# Altium schematic sheet MB1256.SchDoc: MICRO SD Module board
size A4; DocumentNumber: MB1256; Revision: A.1; SheetNumber: 1; SheetTotal: 1; Project: STM32H7-EVAL
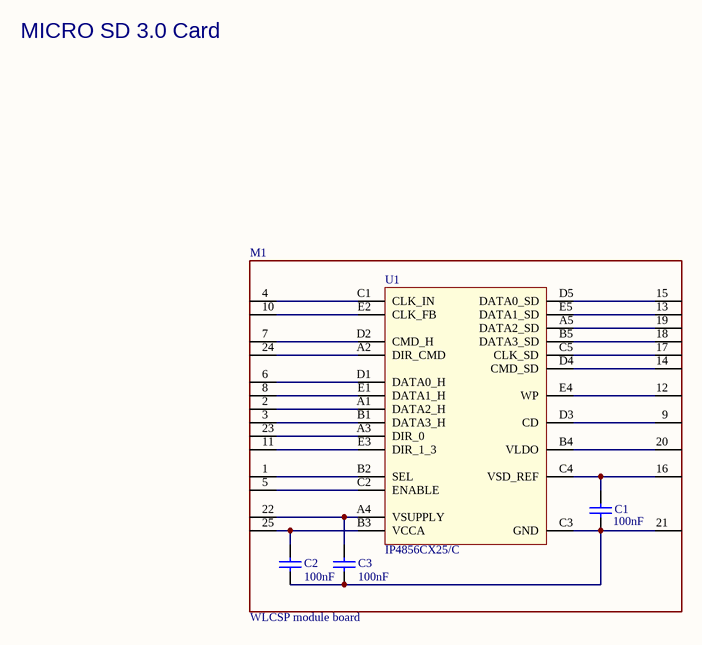
[diagram p0: MB1256.SchDoc]

## Parts
C1  100nF  [0402C]
C2  100nF  [0402C]
C3  100nF  [0402C]
M1  WLCSP module board  [WLCSP25_0R4_2R05X2R05_module]
U1  IP4856CX25/C  [WLCSP25_0R4_2R05X2R05]

## Nets
NetC1_1: C1.1 M1.16(DATA1_SD) U1.C4(VSD_REF)
NetC1_2: C1.2 C2.2 C3.2 M1.21(WP) U1.C3(GND)
NetC2_1: C2.1 M1.25(GND) U1.B3(VCCA)
NetC3_1: C3.1 M1.22(CD) U1.A4(VSUPPLY)
NetM1_1: M1.1(CLK_IN) U1.B2(SEL)
NetM1_2: M1.2(CLK_FB) U1.A1(DATA2_H)
NetM1_3: M1.3(CMD_H) U1.B1(DATA3_H)
NetM1_4: M1.4(DIR_CMD) U1.C1(CLK_IN)
NetM1_5: M1.5(DATA0_H) U1.C2(ENABLE)
NetM1_6: M1.6(DATA1_H) U1.D1(DATA0_H)
NetM1_7: M1.7(DATA2_H) U1.D2(CMD_H)
NetM1_8: M1.8(DATA3_H) U1.E1(DATA1_H)
NetM1_9: M1.9(DIR_0) U1.D3(CD)
NetM1_10: M1.10(DIR_1_3) U1.E2(CLK_FB)
NetM1_11: M1.11(SEL) U1.E3(DIR_1_3)
NetM1_12: M1.12(ENABLE) U1.E4(WP)
NetM1_13: M1.13(VSUPPLY) U1.E5(DATA1_SD)
NetM1_14: M1.14(VCCA) U1.D4(CMD_SD)
NetM1_15: M1.15(DATA0_SD) U1.D5(DATA0_SD)
NetM1_17: M1.17(DATA2_SD) U1.C5(CLK_SD)
NetM1_18: M1.18(DATA3_SD) U1.B5(DATA3_SD)
NetM1_19: M1.19(CLK_SD) U1.A5(DATA2_SD)
NetM1_20: M1.20(CMD_SD) U1.B4(VLDO)
NetM1_23: M1.23(VLDO) U1.A3(DIR_0)
NetM1_24: M1.24(VSD_REF) U1.A2(DIR_CMD)

## Notes on the sheet
- MICRO SD 3.0 Card
- Title:
- Project:
- Size:
- Date:
- A4
- Reference:
- Sheet:
- Revision:
- of

## Library data of the parts
C1-C3 = Cap: Capacitor; Value: 10nF; Published: 8-Jun-2000; Revision: July-2002: Re-released for DXP Platform.; Publisher: Altium Limited
M1 = WLCSP module board: ECCN_US/EU: 3A991
U1 = IP4856CX25/C: SDcard3.0 dual voltage level  translator; ECCN_US/EU: 3A991